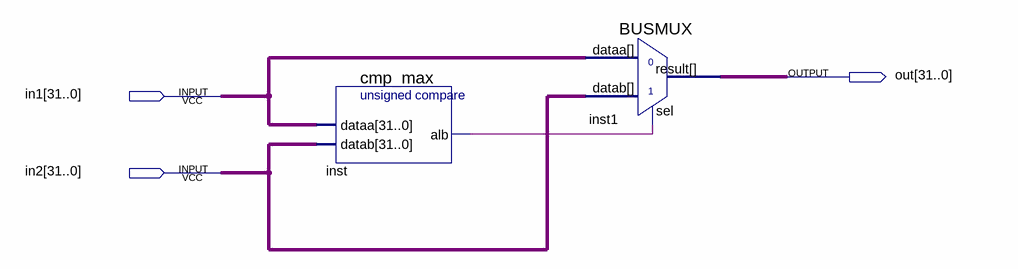
[diagram p0: schematic sheet]
// Quartus schematic max.bdf as structural Verilog: 2 symbols, 3 pins
module max (
  input  [31:0] in1,
  input  [31:0] in2,
  output [31:0] out
);

  wire inst_alb;

  cmp_max inst (.dataa(in1), .datab(in2), .alb(inst_alb));
  BUSMUX inst1 (.datab(in2), .sel(inst_alb), .dataa(in1), .result(out));
endmodule
